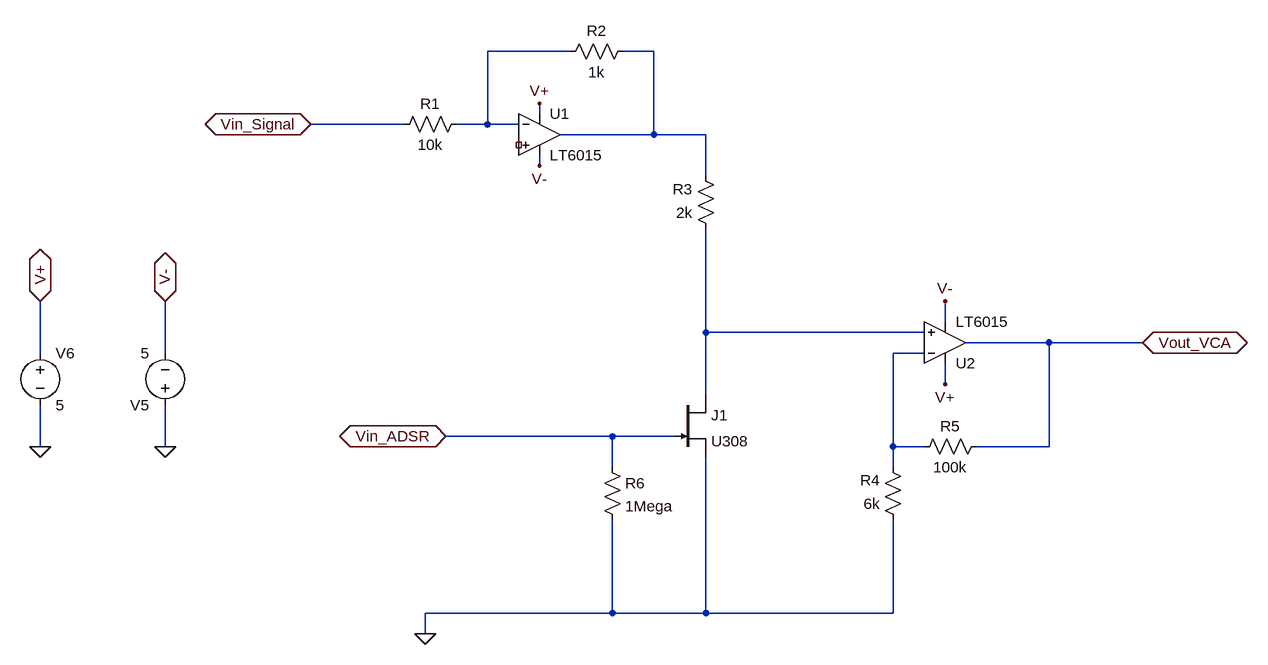
[diagram p0: schematic Amplitude modulator_brief.asc]
Amplitude modulator_brief.asc, the LTspice schematic file:
Version 4
SHEET 1 1112 680
WIRE -272 -512 -400 -512
WIRE -144 -512 -192 -512
WIRE -320 -416 -320 -432
WIRE -528 -400 -672 -400
WIRE -400 -400 -400 -512
WIRE -400 -400 -448 -400
WIRE -352 -400 -400 -400
WIRE -144 -384 -144 -512
WIRE -144 -384 -288 -384
WIRE -64 -384 -144 -384
WIRE -320 -336 -320 -352
WIRE -64 -320 -64 -384
WIRE 304 -96 304 -128
WIRE -64 -80 -64 -240
WIRE 272 -80 -64 -80
WIRE 464 -64 336 -64
WIRE 608 -64 464 -64
WIRE -1088 -48 -1088 -128
WIRE -896 -48 -896 -128
WIRE 272 -48 224 -48
WIRE 304 0 304 -32
WIRE -64 16 -64 -80
WIRE -208 80 -464 80
WIRE -112 80 -208 80
WIRE -1088 96 -1088 32
WIRE -896 96 -896 32
WIRE 224 96 224 -48
WIRE 272 96 224 96
WIRE 464 96 464 -64
WIRE 464 96 352 96
WIRE -208 128 -208 80
WIRE 224 128 224 96
WIRE -208 352 -208 208
WIRE -208 352 -496 352
WIRE -64 352 -64 112
WIRE -64 352 -208 352
WIRE 224 352 224 208
WIRE 224 352 -64 352
WIRE -496 384 -496 352
FLAG -496 384 0
FLAG -464 80 Vin_ADSR
IOPIN -464 80 BiDir
FLAG -1088 96 0
FLAG -1088 -128 V+
IOPIN -1088 -128 BiDir
FLAG -896 -128 V-
IOPIN -896 -128 BiDir
FLAG -896 96 0
FLAG -320 -432 V+
FLAG 304 0 V+
FLAG -320 -336 V-
FLAG 304 -128 V-
FLAG -672 -400 Vin_Signal
IOPIN -672 -400 BiDir
FLAG 608 -64 Vout_VCA
IOPIN 608 -64 BiDir
SYMBOL Opamps\\LT6015 -320 -384 R0
SYMATTR InstName U1
SYMBOL Opamps\\LT6015 304 -64 M180
SYMATTR InstName U2
SYMBOL res -432 -416 R90
WINDOW 0 0 56 VBottom 2
WINDOW 3 32 56 VTop 2
SYMATTR InstName R1
SYMATTR Value 10k
SYMBOL res -176 -528 R90
WINDOW 0 0 56 VBottom 2
WINDOW 3 32 56 VTop 2
SYMATTR InstName R2
SYMATTR Value 1k
SYMBOL res -48 -224 R180
WINDOW 0 36 76 Left 2
WINDOW 3 36 40 Left 2
SYMATTR InstName R3
SYMATTR Value 2k
SYMBOL res 240 224 R180
WINDOW 0 36 76 Left 2
WINDOW 3 36 40 Left 2
SYMATTR InstName R4
SYMATTR Value 6k
SYMBOL res 256 112 R270
WINDOW 0 32 56 VTop 2
WINDOW 3 0 56 VBottom 2
SYMATTR InstName R5
SYMATTR Value 100k
SYMBOL res -224 112 R0
SYMATTR InstName R6
SYMATTR Value 1Mega
SYMBOL njf -112 16 R0
SYMATTR InstName J1
SYMATTR Value U308
SYMBOL voltage -896 48 R180
WINDOW 123 0 0 Left 0
WINDOW 39 0 0 Left 0
SYMATTR InstName V5
SYMATTR Value 5
SYMBOL voltage -1088 -64 R0
WINDOW 123 0 0 Left 0
WINDOW 39 0 0 Left 0
SYMATTR InstName V6
SYMATTR Value 5

The netlist it stands for:
* Amplitude modulator_brief.asc
XU1 NC_01 N001 V+ V- N002 LT6016  ; LT6015, pins In+ In- V+ V- OUT
XU2 N003 N004 V+ V- Vout_VCA LT6016  ; LT6015, pins In+ In- V+ V- OUT
R1 N001 Vin_Signal 10k
R2 N002 N001 1k
R3 N003 N002 2k
R4 0 N004 6k
R5 N004 Vout_VCA 100k
R6 Vin_ADSR 0 1Mega
J1 N003 Vin_ADSR 0 U308
V5 0 V- 5
V6 V+ 0 5
.model NJF NJF
.model PJF PJF
.lib standard.jft
.lib LTC2.lib
.backanno
.end